# Altium project DAC_AD9760.PrjPcb
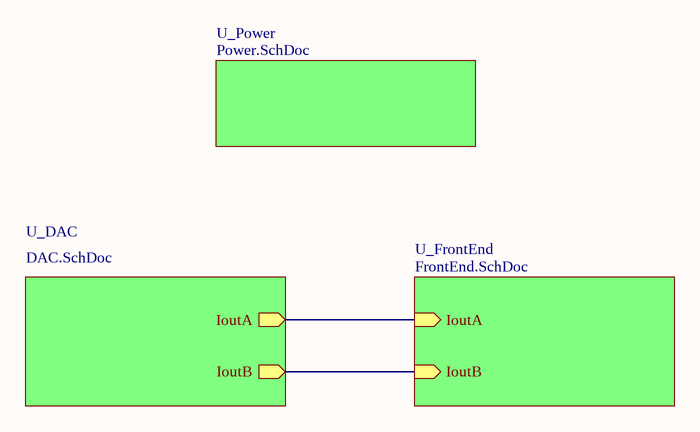
[diagram p0: Top.SchDoc]
4 sheets, 73 parts. Net scope: hierarchical (ports join the sheet entries above them; power ports are global).
Board file: AD9760.PcbDoc
Sheets:
  Top.SchDoc
    U_DAC = DAC.SchDoc
    U_Power = Power.SchDoc
    U_FrontEnd = FrontEnd.SchDoc

## Sheet Top.SchDoc: Projekt DAC AUPSC 2019
size A4; Date: 4.10.2019; Author: Michal Grzegorzek; SheetNumber: 1; SheetTotal: 4; Model: EM1; PageSetup: Record=PageOptions|CenterHorizontal=True|CenterVertical=True|PrintScale=0.52|XCorrection=1.00|YCorrection=1.00|PrintKind=1|BorderSize=5000000|LeftOffset=0|BottomOffset=0|Orientation=2|PaperLength=4200|PaperWidth=2970|Scale=100|PaperSource=7|PrintQuality=600|MediaType=1|DitherType=10|PaperKind=A3|PrintScaleMode=1

### Sub-sheets
U_DAC = DAC.SchDoc: IoutA (out), IoutB (out)
U_FrontEnd = FrontEnd.SchDoc: IoutA (in), IoutB (in)
U_Power = Power.SchDoc: no entries

### Nets
NetC20_1: sheet U_DAC/IoutB, sheet U_FrontEnd/IoutB
NetC20_2: sheet U_DAC/IoutA, sheet U_FrontEnd/IoutA

### Notes on the sheet
- Title:
- Sheet:
- of
- Author:
- Model:
- Document Number:
- Checked by:
- Iss-Rev:
- Approved by:
- Date:
- File name:

## Sheet DAC.SchDoc: Projekt DAC AUPSC 2019
size A4; Date: 4.10.2019; Author: Michał Grzegorzek; Organization: AGH; SheetNumber: 2; SheetTotal: 4; PageSetup: Record=PageOptions|CenterHorizontal=True|CenterVertical=True|PrintScale=0.52|XCorrection=1.00|YCorrection=1.00|PrintKind=1|BorderSize=5000000|LeftOffset=0|BottomOffset=0|Orientation=2|PaperLength=4200|PaperWidth=2970|Scale=100|PaperSource=7|PrintQuality=600|MediaType=1|DitherType=10|PaperKind=A3|PrintScaleMode=1
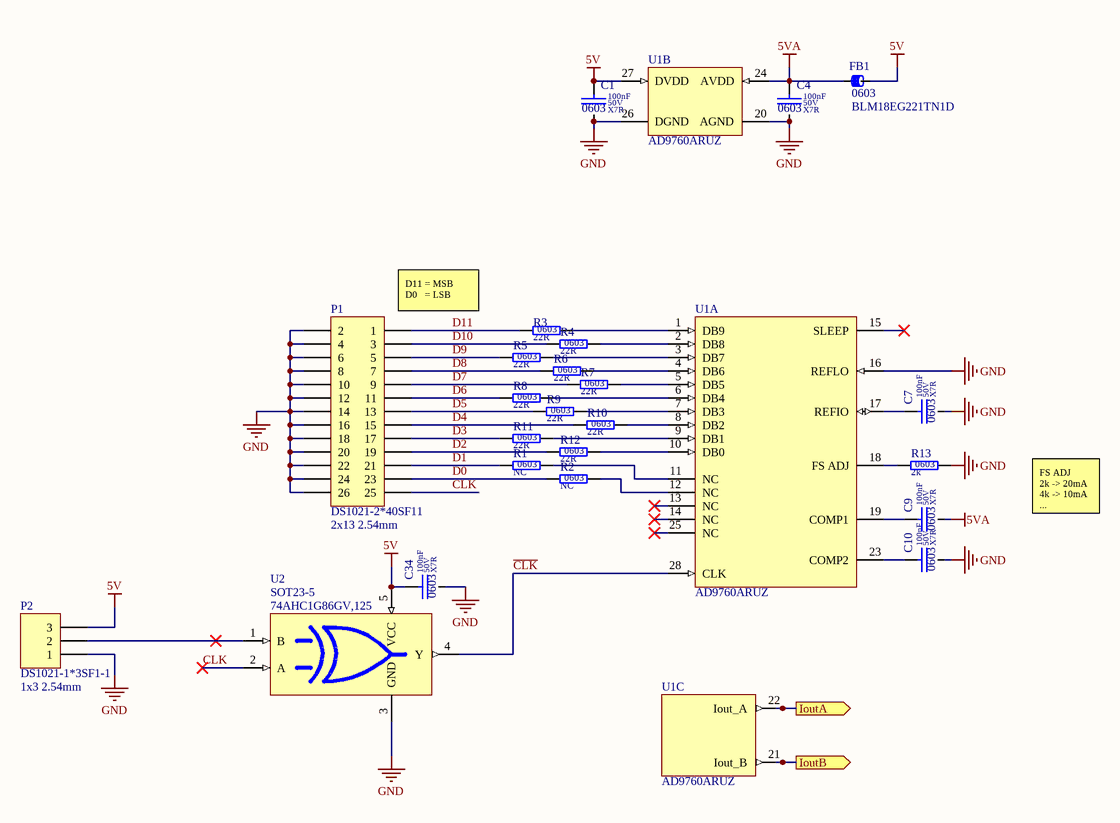
[diagram p1: DAC.SchDoc]

### Parts
C1  value 100nF  Dielectric: X7R  Voltage: 50V  SCH_Footprint: 0603  [C_0603_1608]  (hidden comment: Ceramic X7R)
C4  value 100nF  Dielectric: X7R  Voltage: 50V  SCH_Footprint: 0603  [C_0603_1608]  (hidden comment: Ceramic X7R)
C7  value 100nF  Dielectric: X7R  Voltage: 50V  SCH_Footprint: 0603  [C_0603_1608]  (hidden comment: Ceramic X7R)
C9  value 100nF  Dielectric: X7R  Voltage: 50V  SCH_Footprint: 0603  [C_0603_1608]  (hidden comment: Ceramic X7R)
C10  value 100nF  Dielectric: X7R  Voltage: 50V  SCH_Footprint: 0603  [C_0603_1608]  (hidden comment: Ceramic X7R)
C34  value 100nF  Dielectric: X7R  Voltage: 50V  SCH_Footprint: 0603  [C_0603_1608]  (hidden comment: Ceramic X7R)
FB1  value BLM18EG221TN1D  SCH_Footprint: 0603  [FB_0603_1608]  (hidden comment: Ferrite bead)
P1  value DS1021-2*40SF11  SCH_Footprint: 2x13 2.54mm  [P_HEADER_2x13_2.54]  (hidden comment: Goldpin)
P2  value DS1021-1*3SF1-1  SCH_Footprint: 1x3 2.54mm  [P_HEADER_1x3_2.54]  (hidden comment: Goldpin)
R1  value NC  SCH_Footprint: 0603  [R_NC_0603_1608]  (hidden comment: Resistor)
R2  value NC  SCH_Footprint: 0603  [R_NC_0603_1608]  (hidden comment: Resistor)
R3  value 22R  SCH_Footprint: 0603  [R_0603_1608]  (hidden comment: Resistor)
R4  value 22R  SCH_Footprint: 0603  [R_0603_1608]  (hidden comment: Resistor)
R5  value 22R  SCH_Footprint: 0603  [R_0603_1608]  (hidden comment: Resistor)
R6  value 22R  SCH_Footprint: 0603  [R_0603_1608]  (hidden comment: Resistor)
R7  value 22R  SCH_Footprint: 0603  [R_0603_1608]  (hidden comment: Resistor)
R8  value 22R  SCH_Footprint: 0603  [R_0603_1608]  (hidden comment: Resistor)
R9  value 22R  SCH_Footprint: 0603  [R_0603_1608]  (hidden comment: Resistor)
R10  value 22R  SCH_Footprint: 0603  [R_0603_1608]  (hidden comment: Resistor)
R11  value 22R  SCH_Footprint: 0603  [R_0603_1608]  (hidden comment: Resistor)
R12  value 22R  SCH_Footprint: 0603  [R_0603_1608]  (hidden comment: Resistor)
R13  value 2k  SCH_Footprint: 0603  [R_0603_1608]  (hidden comment: Resistor)
U1  value AD9760ARUZ  [TSSOP28_EP_4X10X12]  (hidden comment: 10-Bit, 125MSPS D/A Converter)  (parts A,B,C of 3)
U2  value 74AHC1G86GV,125  SCH_Footprint: SOT23-5  [SOT23-5_SC74A_SOT753_M]  (hidden comment: 2-input EXCLUSIVE-OR gate)

### Ports
IoutA (out), IoutB (out)

### Nets
5V: C1.1 C34.1 FB1.2 P2.3 U1.27(DVDD) U2.5(VCC)
5VA: C4.1 C9.2 FB1.1 U1.24(AVDD)
GND: C1.2 C4.2 C7.2 C10.2 C34.2 P1.2 P1.4 P1.6 P1.8 P1.10 P1.12 P1.14 P1.16 P1.18 P1.20 P1.22 P1.24 P1.26 P2.1 R13.2 U1.16(REFLO) U1.20(AGND) U1.26(DGND) U2.3(GND)
~{CLK}: U1.28(CLK) U2.4(Y)
CLK: P1.25 U2.2(A)
D0: P1.23 R2.1
D1: P1.21 R1.1
D2: P1.19 R12.1
D3: P1.17 R11.1
D4: P1.15 R10.1
D5: P1.13 R9.1
D6: P1.11 R8.1
D7: P1.9 R7.1
D8: P1.7 R6.1
D9: P1.5 R5.1
D10: P1.3 R4.1
D11: P1.1 R3.1
NetC7_1: C7.1 U1.17(REFIO)
NetC9_1: C9.1 U1.19(COMP1)
NetC10_1: C10.1 U1.23(COMP2)
NetC20_1: U1.21(Iout_B) ; port IoutB
NetC20_2: U1.22(Iout_A) ; port IoutA
NetP2_2: P2.2 U2.1(B)
NetR1_2: R1.2 U1.11(NC)
NetR2_2: R2.2 U1.12(NC)
NetR3_2: R3.2 U1.1(DB9)
NetR4_2: R4.2 U1.2(DB8)
NetR5_2: R5.2 U1.3(DB7)
NetR6_2: R6.2 U1.4(DB6)
NetR7_2: R7.2 U1.5(DB5)
NetR8_2: R8.2 U1.6(DB4)
NetR9_2: R9.2 U1.7(DB3)
NetR10_2: R10.2 U1.8(DB2)
NetR11_2: R11.2 U1.9(DB1)
NetR12_2: R12.2 U1.10(DB0)
NetR13_1: R13.1 U1.18(FS_ADJ)

Not connected (* = marked no-connect by the designer): U1 13(NC)* 14(NC)* 15(SLEEP)* 25(NC)*

### Notes on the sheet
- (near P1) D11 = MSB
  D0   = LSB
- FS ADJ
  2k -> 20mA
  4k -> 10mA
  ...
- Title:
- Sheet:
- of
- Author:
- Model:
- Document Number:
- Checked by:
- Iss-Rev:
- Approved by:
- Date:
- File name:

### Library data of the parts
C1 C4 C7 C9 C10 C34 = C_100nF_50V_X7R_0603_5: Capacitor; Manufacturer: Samsung; Manufacturer Part Number: CL10B104JB8NNNC; Tolerance (%): 5; Part Number: C_100nF_50V_X7R_0603_5; HelpURL: http://www.tme.eu/pl/Document/4a42202b32dab16128fe107dd69598cc/samsung-chip-cap.pdf; Supplier 1: TME; Supplier Part Number 1: CL10B104JB8NNNC; Supplier 2: RS Components; Supplier 3: Farnell; Supplier 4: Mouser; Supplier 5: Digi-Key
FB1 = FB_BLM18EG221TN1D: Manufacturer: Murata; Current: 1A; Resistance: 150mR; Part Number: FB_BLM18EG221TN1D; HelpURL: http://datasheet.octopart.com/BLM18EG221TN1D-Murata-datasheet-66919.pdf; Manufacturer Part Number: BLM18EG221TN1D; Supplier 1: TME; Supplier 2: RS Components; Supplier Part Number 2: 7926243P; Supplier 3: Farnell; Supplier Part Number 3: 1515717; Supplier 4: Mouser; Supplier Part Number 4: 81-BLM18EG221TN1D; Supplier 5: Digi-Key; Supplier Part Number 5: 490-5979-1-ND
P1 = P_HEADER_2x13_2.54: Header, 26-Pin, Dual row; Manufacturer: Connfly; Part Number: P_HEADER_2x13_2.54; Component Type: Standard; HelpURL: http://www.tme.eu/pl/details/zl202-80g/listwy-i-gniazda-kolkowe/connfly/ds1021-2_40sf11/; Manufacturer Part Number: DS1021-2*40SF11; Supplier 1: TME; Supplier Part Number 1: ZL202-80G; Supplier 2: RS Components; Supplier 3: Farnell; Supplier 4: Mouser; Supplier 5: Digi-Key
P2 = P_HEADER_1x3_2.54: Header, 3-Pin; Manufacturer: Connfly; Part Number: P_HEADER_1x3_2.54; Component Type: Standard; HelpURL: http://www.tme.eu/en/Document/cc301e58a5da78cb543a94b5a5b7f06a/DS1021.pdf; Manufacturer Part Number: DS1021-1*3SF1-1; Supplier 1: TME; Supplier Part Number 1: ZL201-03G; Supplier 2: RS Components; Supplier 3: Farnell; Supplier 4: Mouser; Supplier 5: Digi-Key
R1 R2 = R_GENERIC_0603: Part Number: R_GENERIC_0603; Supplier 1: TME; Supplier 2: RS Components; Supplier 3: Farnell; Supplier 4: Mouser; Supplier 5: Digi-Key
R3-R12 = R_22R_0603_5: Manufacturer: Walsin; Manufacturer Part Number: WF06P220JTL; Voltage: 50V; Power: 125mW; Tolerance: 5%; Part Number: R_22R_0603_5; HelpURL: http://www.tme.eu/pl/Document/b315665a56acbc42df513c99b390ad98/ROYALOHM-THICKFILM.pdf; Supplier 1: TME; Supplier Part Number 1: WF06P-22R-5%; Supplier 2: RS Components; Supplier 3: Farnell; Supplier 4: Mouser; Supplier 5: Digi-Key
R13 = R_2k_0603_1: Manufacturer: Yageo; Manufacturer Part Number: RC0603FR-072KL; Voltage: 50V; Power: 100mW; Tolerance: 1%; Part Number: R_2k_0603_1; HelpURL: http://datasheet.octopart.com/RC0603FR-072KL-Yageo-datasheet-8328172.pdf; Supplier 1: TME; Supplier Part Number 1: RC0603FR-072K; Supplier 2: RS Components; Supplier 3: Farnell; Supplier 4: Mouser; Supplier Part Number 4: 603-RC0603FR-072KL; Supplier 5: Digi-Key; Supplier Part Number 5: 311-2.00KHRCT-ND
U1 = U_AD9760ARUZ: 10-Bit 125Msps DACs; Manufacturer: Analog Devices; SCH_Footprint: TSSOP28; Part Number: U_AD9760ARUZ; HelpURL: https://www.analog.com/media/en/technical-documentation/data-sheets/AD9760.pdf; Manufacturer Part Number: AD9760ARUZ; Supplier 1: TME; Supplier 2: RS Components; Supplier 3: Farnell; Supplier Part Number 3: 2192248; Supplier 4: Mouser; Supplier Part Number 4: 584-AD9760ARUZ; Supplier 5: Digi-Key; Supplier Part Number 5: AD9760ARUZ-ND
U2 = U_74AHC1G86GV.125: Manufacturer: Nexperia; Part Number: U_74AHC1G86GV.125; HelpURL: https://assets.nexperia.cn/documents/data-sheet/74AHC_AHCT1G86_Q100.pdf; Manufacturer Part Number: 74AHC1G86GV,125; Supplier 1: TME; Supplier Part Number 1: 74AHC1G86GV.125; Supplier 2: RS Components; Supplier Part Number 2: 146-0517; Supplier 3: Farnell; Supplier Part Number 3: 2777697; Supplier 4: Mouser; Supplier Part Number 4: 771-AHC1G86GV125; Supplier 5: Digi-Key; Supplier Part Number 5: 1727-4201-2-ND

## Sheet Power.SchDoc: Projekt DAC AUPSC 2019
size A4; Date: 4.10.2019; Author: Michal Grzegorzek; SheetNumber: 4; SheetTotal: 4; Model: EM1; PageSetup: Record=PageOptions|CenterHorizontal=True|CenterVertical=True|PrintScale=0.52|XCorrection=1.00|YCorrection=1.00|PrintKind=1|BorderSize=5000000|LeftOffset=0|BottomOffset=0|Orientation=2|PaperLength=4200|PaperWidth=2970|Scale=100|PaperSource=7|PrintQuality=600|MediaType=1|DitherType=10|PaperKind=A3|PrintScaleMode=1
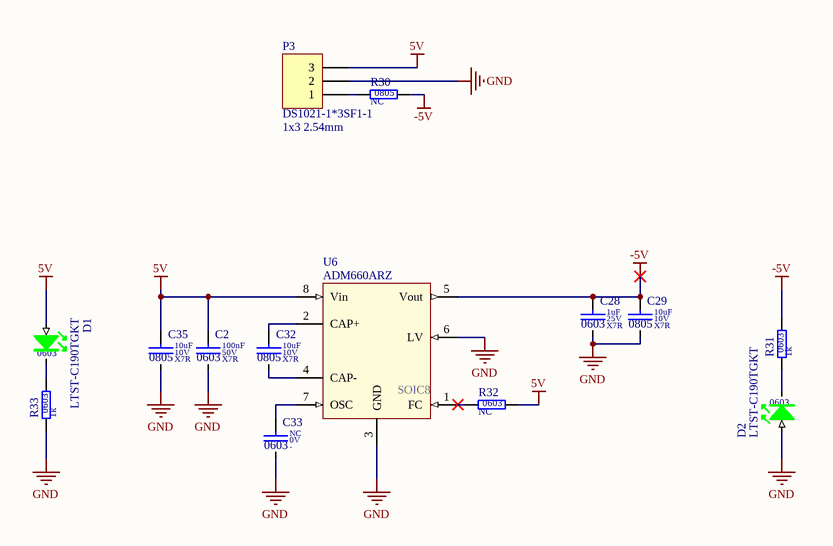
[diagram p2: Power.SchDoc]

### Parts
C2  value 100nF  Dielectric: X7R  Voltage: 50V  SCH_Footprint: 0603  [C_0603_1608]  (hidden comment: Ceramic X7R)
C28  value 1uF  Dielectric: X7R  Voltage: 25V  SCH_Footprint: 0603  [C_0603_1608]  (hidden comment: Ceramic X7R)
C29  value 10uF  Dielectric: X7R  Voltage: 10V  SCH_Footprint: 0805  [C_0805_2012]  (hidden comment: Ceramic X7R)
C32  value 10uF  Dielectric: X7R  Voltage: 10V  SCH_Footprint: 0805  [C_0805_2012]  (hidden comment: Ceramic X7R)
C33  value NC  Voltage: 0V  SCH_Footprint: 0603  [C_NC_0603_1608]  (hidden comment: -)
C35  value 10uF  Dielectric: X7R  Voltage: 10V  SCH_Footprint: 0805  [C_0805_2012]  (hidden comment: Ceramic X7R)
D1  value LTST-C190TGKT  SCH_Footprint: 0603  [OL_0603_1608]  (hidden comment: Green Led)
D2  value LTST-C190TGKT  SCH_Footprint: 0603  [OL_0603_1608]  (hidden comment: Green Led)
P3  value DS1021-1*3SF1-1  SCH_Footprint: 1x3 2.54mm  [P_HEADER_1x3_2.54]  (hidden comment: Goldpin)
R30  value NC  SCH_Footprint: 0805  [R_NC_0805_2012]  (hidden comment: Resistor)
R31  value 1k  SCH_Footprint: 0603  [R_0603_1608]  (hidden comment: Resistor)
R32  value NC  SCH_Footprint: 0603  [R_NC_0603_1608]  (hidden comment: Resistor)
R33  value 1k  SCH_Footprint: 0603  [R_0603_1608]  (hidden comment: Resistor)
U6  value ADM660ARZ  SCH_Footprint: SOIC8  [SOP8_SO8_SOIC8_4X5X18]  (hidden comment: ADM660)

### Nets
5V: C2.1 C35.1 D1.2(A) P3.3 R32.2 U6.8(Vin)
-5V: C28.1 C29.1 R30.2 R31.2 U6.5(Vout)
GND: C2.2 C28.2 C29.2 C33.2 C35.2 D2.2(A) P3.2 R33.1 U6.3(GND) U6.6(LV)
NetC32_1: C32.1 U6.2(CAP+)
NetC32_2: C32.2 U6.4(CAP-)
NetC33_1: C33.1 U6.7(OSC)
NetD1_1: D1.1(K) R33.2
NetD2_1: D2.1(K) R31.1
NetP3_1: P3.1 R30.1
NetR32_1: R32.1 U6.1(FC)

### Notes on the sheet
- Title:
- Sheet:
- of
- Author:
- Model:
- Document Number:
- Checked by:
- Iss-Rev:
- Approved by:
- Date:
- File name:

### Library data of the parts
C2 = C_100nF_50V_X7R_0603_5: as C1 on sheet DAC; Part Number: C_100nF_50V_X7R_0603_5; HelpURL: http://www.tme.eu/pl/Document/4a42202b32dab16128fe107dd69598cc/samsung-chip-cap.pdf; Supplier 1: TME; Supplier Part Number 1: CL10B104JB8NNNC; Supplier 2: RS Components; Supplier 3: Farnell; Supplier 4: Mouser; Supplier 5: Digi-Key
C28 = C_1uF_25V_X7R_0603_10: Capacitor; Manufacturer: Samsung; Manufacturer Part Number: CL10B105KA8NNNC; Tolerance (%): 10; Part Number: C_1uF_25V_X7R_0603_10; HelpURL: http://www.tme.eu/pl/Document/4a42202b32dab16128fe107dd69598cc/samsung-chip-cap.pdf; Supplier 1: TME; Supplier Part Number 1: CL10B105KA8NNNC; Supplier 2: RS Components; Supplier 3: Farnell; Supplier 4: Mouser; Supplier 5: Digi-Key
C29 C32 C35 = C_10uF_10V_X7R_0805_10: Capacitor; Manufacturer: Samsung Electro-Mechanics; Manufacturer Part Number: CL21B106KPQNNNG; Tolerance (%): 10; Part Number: C_10uF_10V_X7R_0805_10; HelpURL: http://www.tme.eu/pl/Document/4a42202b32dab16128fe107dd69598cc/samsung-chip-cap.pdf; Supplier 1: TME; Supplier Part Number 1: CL21B106KPQNNNG; Supplier 2: RS Components; Supplier 3: Farnell; Supplier 4: Mouser; Supplier 5: Digi-Key
C33 = C_GENERIC_0603: Capacitor; Tolerance (%): 0; Dielectric: -; Part Number: C_GENERIC_0603; HelpURL: http://-; Manufacturer: -; Manufacturer Part Number: -; Supplier 1: TME; Supplier 2: RS Components; Supplier 3: Farnell; Supplier 4: Mouser; Supplier 5: Digi-Key
D1 D2 = OL_G_0603: LED GREEN; Manufacturer: Lite-On; Part Number: OL_G_0603; HelpURL: https://datasheet.octopart.com/LTST-C190TGKT-Lite-On-datasheet-158437.pdf; Manufacturer Part Number: LTST-C190TGKT; Supplier 1: TME; Supplier Part Number 1: LTST-C190TGKT; Supplier 2: RS Components; Supplier Part Number 2: 6920997P; Supplier 3: Farnell; Supplier 4: Mouser; Supplier Part Number 4: 859-LTST-C190TGKT; Supplier 5: Digi-Key; Supplier Part Number 5: 160-2019-1-ND
P3 = P_HEADER_1x3_2.54: Header, 3-Pin; Manufacturer: Connfly; Part Number: P_HEADER_1x3_2.54; Component Type: Standard; HelpURL: http://www.tme.eu/en/Document/cc301e58a5da78cb543a94b5a5b7f06a/DS1021.pdf; Manufacturer Part Number: DS1021-1*3SF1-1; Supplier 1: TME; Supplier Part Number 1: ZL201-03G; Supplier 2: RS Components; Supplier 3: Farnell; Supplier 4: Mouser; Supplier 5: Digi-Key
R30 = R_GENERIC_0805: Part Number: R_GENERIC_0805; Supplier 1: TME; Supplier 2: RS Components; Supplier 3: Farnell; Supplier 4: Mouser; Supplier 5: Digi-Key
R31 R33 = R_1k_0603_1: Manufacturer: Vishay; Manufacturer Part Number: CRCW06031K00FKEA; Voltage: 75V; Power: 100mW; Tolerance: 1%; Part Number: R_1k_0603_1; HelpURL: http://www.farnell.com/datasheets/2310790.pdf?_ga=2.256888843.1690599162.1548417389-1379097396.1542296996&_gac=1.262631934.1547230258.Cj0KCQiAmuHhBRD0ARIsAFWyPwhX8HcvXnM3tA0ZBodZLzDIjH2ZxLpjT5LWo9bad_HPRbU8LfPq44UaAhEwEALw_wcB; Supplier 1: TME; Supplier 2: RS Components; Supplier Part Number 2: 678-9875P; Supplier 3: Farnell; Supplier Part Number 3: 1469740; Supplier 4: Mouser; Supplier Part Number 4: 71-CRCW0603-1.0K-E3; Supplier 5: Digi-Key; Supplier Part Number 5: 541-1.00KHCT-ND
R32 = R_GENERIC_0603: Part Number: R_GENERIC_0603; Supplier 1: TME; Supplier 2: RS Components; Supplier 3: Farnell; Supplier 4: Mouser; Supplier 5: Digi-Key
U6 = VS_ADM660ARZ: Manufacturer: Analog Devices; Frequency (kHz): 25; Topology: Other; Vin min (V): 1,5; Vin max (V): 7; Vout min (V): -7; Vout max (V): -1,5; Imax (A): 0,1; Iswitch (A): 0; Part Number: VS_ADM660ARZ; HelpURL: https://www.analog.com/media/en/technical-documentation/data-sheets/ADM660_8660.pdf; Manufacturer Part Number: ADM660ARZ; Supplier 1: TME; Supplier 2: RS Components; Supplier 3: Farnell; Supplier Part Number 3: 1661070; Supplier 4: Mouser; Supplier Part Number 4: 584-ADM660ARZ; Supplier 5: Digi-Key; Supplier Part Number 5: ADM660ARZ-ND

## Sheet FrontEnd.SchDoc: Projekt DAC AUPSC 2019
size A4; Date: 4.10.2019; Author: Michal Grzegorzek; SheetNumber: 3; SheetTotal: 4; Model: EM1; PageSetup: Record=PageOptions|CenterHorizontal=True|CenterVertical=True|PrintScale=0.52|XCorrection=1.00|YCorrection=1.00|PrintKind=1|BorderSize=5000000|LeftOffset=0|BottomOffset=0|Orientation=2|PaperLength=4200|PaperWidth=2970|Scale=100|PaperSource=7|PrintQuality=600|MediaType=1|DitherType=10|PaperKind=A3|PrintScaleMode=1
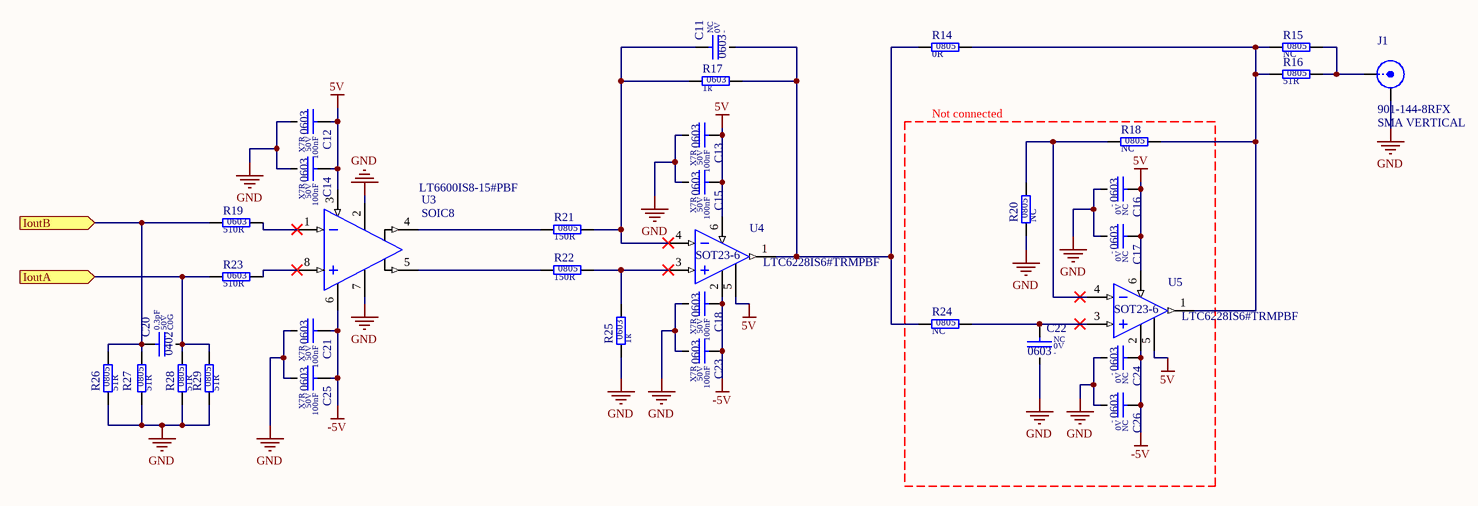
[diagram p3: FrontEnd.SchDoc]

### Parts
C11  value NC  Voltage: 0V  SCH_Footprint: 0603  [C_NC_0603_1608]  (hidden comment: -)
C12  value 100nF  Dielectric: X7R  Voltage: 50V  SCH_Footprint: 0603  [C_0603_1608]  (hidden comment: Ceramic X7R)
C13  value 100nF  Dielectric: X7R  Voltage: 50V  SCH_Footprint: 0603  [C_0603_1608]  (hidden comment: Ceramic X7R)
C14  value 100nF  Dielectric: X7R  Voltage: 50V  SCH_Footprint: 0603  [C_0603_1608]  (hidden comment: Ceramic X7R)
C15  value 100nF  Dielectric: X7R  Voltage: 50V  SCH_Footprint: 0603  [C_0603_1608]  (hidden comment: Ceramic X7R)
C16  value NC  Voltage: 0V  SCH_Footprint: 0603  [C_NC_0603_1608]  (hidden comment: -)
C17  value NC  Voltage: 0V  SCH_Footprint: 0603  [C_NC_0603_1608]  (hidden comment: -)
C18  value 100nF  Dielectric: X7R  Voltage: 50V  SCH_Footprint: 0603  [C_0603_1608]  (hidden comment: Ceramic X7R)
C20  value 0.3pF  Dielectric: C0G  Voltage: 50V  SCH_Footprint: 0402  [C_0402_1005]  (hidden comment: Ceramic C0G)
C21  value 100nF  Dielectric: X7R  Voltage: 50V  SCH_Footprint: 0603  [C_0603_1608]  (hidden comment: Ceramic X7R)
C22  value NC  Voltage: 0V  SCH_Footprint: 0603  [C_NC_0603_1608]  (hidden comment: -)
C23  value 100nF  Dielectric: X7R  Voltage: 50V  SCH_Footprint: 0603  [C_0603_1608]  (hidden comment: Ceramic X7R)
C24  value NC  Voltage: 0V  SCH_Footprint: 0603  [C_NC_0603_1608]  (hidden comment: -)
C25  value 100nF  Dielectric: X7R  Voltage: 50V  SCH_Footprint: 0603  [C_0603_1608]  (hidden comment: Ceramic X7R)
C26  value NC  Voltage: 0V  SCH_Footprint: 0603  [C_NC_0603_1608]  (hidden comment: -)
J1  value 901-144-8RFX  [J_SMA_VERTICAL]  (hidden comment: SMA VERTICAL)
R14  value 0R  SCH_Footprint: 0805  [R_0805_2012]  (hidden comment: Resistor)
R15  value NC  SCH_Footprint: 0805  [R_NC_0805_2012]  (hidden comment: Resistor)
R16  value 51R  SCH_Footprint: 0805  [R_0805_2012]  (hidden comment: Resistor)
R17  value 1k  SCH_Footprint: 0603  [R_0603_1608]  (hidden comment: Resistor)
R18  value NC  SCH_Footprint: 0805  [R_NC_0805_2012]  (hidden comment: Resistor)
R19  value 510R  SCH_Footprint: 0603  [R_0603_1608]  (hidden comment: Resistor)
R20  value NC  SCH_Footprint: 0805  [R_NC_0805_2012]  (hidden comment: Resistor)
R21  value 150R  SCH_Footprint: 0805  [R_0805_2012]  (hidden comment: Resistor)
R22  value 150R  SCH_Footprint: 0805  [R_0805_2012]  (hidden comment: Resistor)
R23  value 510R  SCH_Footprint: 0603  [R_0603_1608]  (hidden comment: Resistor)
R24  value NC  SCH_Footprint: 0805  [R_NC_0805_2012]  (hidden comment: Resistor)
R25  value 1k  SCH_Footprint: 0603  [R_0603_1608]  (hidden comment: Resistor)
R26  value 51R  SCH_Footprint: 0805  [R_0805_2012]  (hidden comment: Resistor)
R27  value 51R  SCH_Footprint: 0805  [R_0805_2012]  (hidden comment: Resistor)
R28  value 51R  SCH_Footprint: 0805  [R_0805_2012]  (hidden comment: Resistor)
R29  value 51R  SCH_Footprint: 0805  [R_0805_2012]  (hidden comment: Resistor)
U3  SCH_Footprint: SOIC8  [SOP8_SO8_SOIC8_4X5X18]  (hidden comment: LT6600IS8-15#PBF)
U4  value LTC6228IS6#TRMPBF  SCH_Footprint: SOT23-6  [SOT23-6_SC74A_SOT753]  (hidden comment: LTC6228IS6)
U5  value LTC6228IS6#TRMPBF  SCH_Footprint: SOT23-6  [SOT23-6_SC74A_SOT753]  (hidden comment: LTC6228IS6)

### Blocks framed on the sheet
Not connected: C16 C17 C22 C24 C26 R18 R20 R24 U5

### Ports
IoutA (in), IoutB (in)

### Nets
5V: C12.1 C13.1 C14.1 C15.1 C16.1 C17.1 U3.3(VDD) U4.5(~{SHDN}) U4.6(VDD) U5.5(~{SHDN}) U5.6(VDD)
-5V: C18.1 C21.1 C23.1 C24.1 C25.1 C26.1 U3.6(GND) U4.2(GND) U5.2(GND)
GND: C12.2 C13.2 C14.2 C15.2 C16.2 C17.2 C18.2 C21.2 C22.2 C23.2 C24.2 C25.2 C26.2 J1.2(GND) R20.1 R25.1 R26.1 R27.1 R28.1 R29.1 U3.2(Vocm) U3.7(Vmid)
NetC11_1: C11.1 R17.1 R21.2 U4.4(IN-)
NetC11_2: C11.2 R14.1 R17.2 R24.1 U4.1(OUT)
NetC20_1: C20.1 R19.1 R26.2 R27.2 ; port IoutB
NetC20_2: C20.2 R23.1 R28.2 R29.2 ; port IoutA
NetC22_1: C22.1 R24.2 U5.3(IN+)
NetJ1_1: J1.1(X) R15.2 R16.2
NetR14_2: R14.2 R15.1 R16.1 R18.2 U5.1(OUT)
NetR18_1: R18.1 R20.2 U5.4(IN-)
NetR19_2: R19.2 U3.1(IN-)
NetR21_1: R21.1 U3.4(OUT+)
NetR22_1: R22.1 U3.5(OUT-)
NetR22_2: R22.2 R25.2 U4.3(IN+)
NetR23_2: R23.2 U3.8(IN+)

### Notes on the sheet
- Title:
- Sheet:
- of
- Author:
- Model:
- Document Number:
- Checked by:
- Iss-Rev:
- Approved by:
- Date:
- File name:

### Library data of the parts
C11 C16 C17 C22 C24 C26 = C_GENERIC_0603: Capacitor; Tolerance (%): 0; Dielectric: -; Part Number: C_GENERIC_0603; HelpURL: http://-; Manufacturer: -; Manufacturer Part Number: -; Supplier 1: TME; Supplier 2: RS Components; Supplier 3: Farnell; Supplier 4: Mouser; Supplier 5: Digi-Key
C12-C15 C18 C21 C23 C25 = C_100nF_50V_X7R_0603_5: as C1 on sheet DAC; Part Number: C_100nF_50V_X7R_0603_5; HelpURL: http://www.tme.eu/pl/Document/4a42202b32dab16128fe107dd69598cc/samsung-chip-cap.pdf; Supplier 1: TME; Supplier Part Number 1: CL10B104JB8NNNC; Supplier 2: RS Components; Supplier 3: Farnell; Supplier 4: Mouser; Supplier 5: Digi-Key
C20 = C_0.3pF_50V_C0G_0402_33: Capacitor; Manufacturer: Kemet; Manufacturer Part Number: CBR04C308B5GAC; Tolerance (%): 33; Part Number: C_0.3pF_50V_C0G_0402_33; HelpURL: http://www.farnell.com/datasheets/2202355.pdf; Supplier 1: TME; Supplier 2: RS Components; Supplier Part Number 2: 7697024; Supplier 3: Farnell; Supplier Part Number 3: 1973007; Supplier 4: Mouser; Supplier Part Number 4: 80-CBR04C308B5G; Supplier 5: Digi-Key; Supplier Part Number 5: 399-6155-1-ND
J1 = J_SMA_VERTICAL: SMA connector; Manufacturer: Amphenol RF; Part Number: J_SMA_VERTICAL; SCH_Footprint: SMA VERTICAL; Component Type: Standard; HelpURL: http://www.mouser.com/ds/2/18/C901-144-8RFX-710432.pdf; Manufacturer Part Number: 901-144-8RFX; Supplier 1: TME; Supplier 2: RS Components; Supplier 3: Farnell; Supplier Part Number 3: 1339820; Supplier 4: Mouser; Supplier Part Number 4: 523-901-144-8RFX; Supplier 5: Digi-Key; Supplier Part Number 5: ARFX1231-ND
R14 = R_0R_0805_5: Manufacturer: Stackpole Electronics Inc.; Manufacturer Part Number: RMCF0805ZT0R00; Voltage: 150V; Power: 125mW; Tolerance: 5%; Part Number: R_0R_0805_5; HelpURL: https://www.seielect.com/Catalog/SEI-RMCF_RMCP.pdf; Supplier 1: TME; Supplier 2: RS Components; Supplier 3: Farnell; Supplier 4: Mouser; Supplier 5: Digi-Key; Supplier Part Number 5: RMCF0805ZT0R00CT-ND
R15 R18 R20 R24 = R_GENERIC_0805: Part Number: R_GENERIC_0805; Supplier 1: TME; Supplier 2: RS Components; Supplier 3: Farnell; Supplier 4: Mouser; Supplier 5: Digi-Key
R16 R26-R29 = R_51R_0805_1: Manufacturer: Royalohm; Manufacturer Part Number: 0805S8F510JT5E; Voltage: 150V; Power: 125mW; Tolerance: 1%; Part Number: R_51R_0805_1; HelpURL: https://www.tme.eu/pl/Document/b315665a56acbc42df513c99b390ad98/ROYALOHM-THICKFILM.pdf; Supplier 1: TME; Supplier Part Number 1: SMD0805-51R-1%; Supplier 2: RS Components; Supplier 3: Farnell; Supplier 4: Mouser; Supplier 5: Digi-Key
R17 R25 = R_1k_0603_1: as R31 on sheet Power; Part Number: R_1k_0603_1; HelpURL: http://www.farnell.com/datasheets/2310790.pdf?_ga=2.256888843.1690599162.1548417389-1379097396.1542296996&_gac=1.262631934.1547230258.Cj0KCQiAmuHhBRD0ARIsAFWyPwhX8HcvXnM3tA0ZBodZLzDIjH2ZxLpjT5LWo9bad_HPRbU8LfPq44UaAhEwEALw_wcB; Supplier 1: TME; Supplier 2: RS Components; Supplier Part Number 2: 678-9875P; Supplier 3: Farnell; Supplier Part Number 3: 1469740; Supplier 4: Mouser; Supplier Part Number 4: 71-CRCW0603-1.0K-E3; Supplier 5: Digi-Key; Supplier Part Number 5: 541-1.00KHCT-ND
R19 R23 = R_510R_0603_1: Manufacturer: Vishay; Manufacturer Part Number: CRCW0603510RFKTABC; Voltage: 75V; Power: 100mW; Tolerance: 1%; Part Number: R_510R_0603_1; HelpURL: https://www.tme.eu/pl/Document/622e28308c06d160637f2b14751ba16b/Data%20Sheet%20CRCW_BCe3.pdf; Supplier 1: TME; Supplier Part Number 1: CRCW0603510RFKTABC; Supplier 2: RS Components; Supplier 3: Farnell; Supplier 4: Mouser; Supplier Part Number 4: 71-CRCW0603-510; Supplier 5: Digi-Key
R21 R22 = R_150R_0805_1: Manufacturer: Royalohm; Manufacturer Part Number: 0805S8F1503T5E; Voltage: 150V; Power: 125mW; Tolerance: 1%; Part Number: R_150R_0805_1; HelpURL: https://www.tme.eu/pl/Document/b315665a56acbc42df513c99b390ad98/ROYALOHM-THICKFILM.pdf; Supplier 1: TME; Supplier Part Number 1: SMD0805-150K-1%; Supplier 2: RS Components; Supplier 3: Farnell; Supplier 4: Mouser; Supplier 5: Digi-Key
U3 = U_LT6600IS8-15#PBF: Manufacturer: Analog Devices; Part Number: U_LT6600IS8-15#PBF; Value: LT6600IS8-15#PBF; HelpURL: https://www.analog.com/media/en/technical-documentation/data-sheets/660015fb.pdf; Manufacturer Part Number: LT6600IS8-15#PBF; Supplier 1: TME; Supplier 2: RS Components; Supplier 3: Farnell; Supplier 4: Mouser; Supplier Part Number 4: 584-LT6600IS8-15#PBF; Supplier 5: Digi-Key; Supplier Part Number 5: LT6600IS8-15#PBF-ND
U4 U5 = U_LTC6228IS6#TRPBF: Manufacturer: Analog Devices; Part Number: U_LTC6228IS6#TRPBF; HelpURL: https://www.analog.com/media/en/technical-documentation/data-sheets/LTC6228-6229.pdf; Manufacturer Part Number: LTC6228IS6#TRMPBF; Supplier 1: TME; Supplier 2: RS Components; Supplier 3: Farnell; Supplier 4: Mouser; Supplier Part Number 4: 584-6228IS6#TRMPBF; Supplier 5: Digi-Key; Supplier Part Number 5: LTC6228IS6#TRMPBFCT-ND

## Nets that join several sheets
5V: DAC (6 pins), Power (6 pins), FrontEnd (11 pins)
-5V: Power (5 pins), FrontEnd (9 pins)
GND: DAC (24 pins), Power (10 pins), FrontEnd (22 pins)
NetC20_1: DAC (U1.21), FrontEnd (C20.1 R19.1 R26.2 R27.2)
NetC20_2: DAC (U1.22), FrontEnd (C20.2 R23.1 R28.2 R29.2)